# Altium schematic sheet Ball Gripper's Diodes and Fototransistors Connectors.SchDoc
size A4
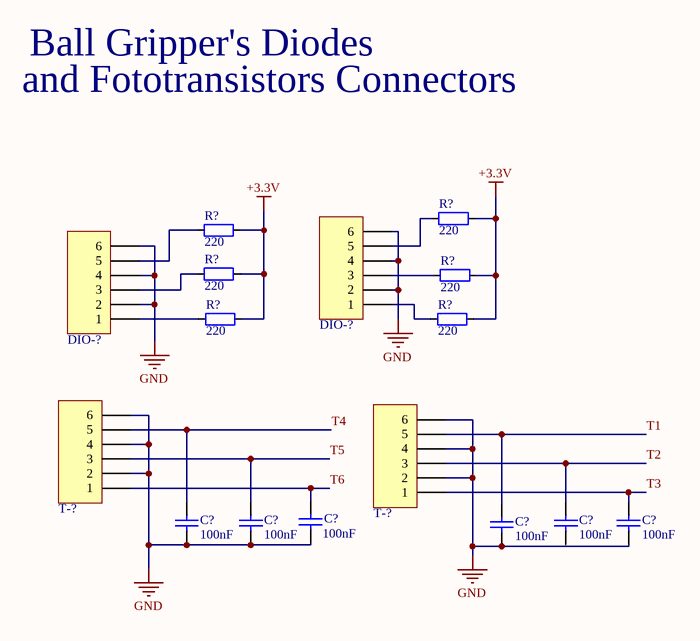
[diagram p0: Ball Gripper's Diodes and Fototransistors Connectors.SchDoc]

## Parts
(Parts that share a designator on the sheet are numbered #1, #2 ... from top to bottom, then left to right.)
C?#1  value 100nF  [0603_CAP]  (hidden comment: Cap)
C?#2  value 100nF  [0603_CAP]  (hidden comment: Cap)
C?#3  value 100nF  [0603_CAP]  (hidden comment: Cap)
C?#4  value 100nF  [0603_CAP]  (hidden comment: Cap)
C?#5  value 100nF  [0603_CAP]  (hidden comment: Cap)
C?#6  value 100nF  [0603_CAP]  (hidden comment: Cap)
DIO-?#1  HDR1X6  [Molex SPOX Horizontal 6 Circuits]  (value not drawn)
DIO-?#2  HDR1X6  [Molex SPOX Horizontal 6 Circuits]  (value not drawn)
R?#1  220  [0603]
R?#2  220  [0603]
R?#3  220  [0603]
R?#4  220  [0603]
R?#5  220  [0603]
R?#6  220  [0603]
T-?#1  HDR1X6  [Molex SPOX Horizontal 6 Circuits]  (value not drawn)
T-?#2  HDR1X6  [Molex SPOX Horizontal 6 Circuits]  (value not drawn)

## Nets
+3.3V: R?#1.1 R?#2.1 R?#3.1 R?#4.1 R?#5.1 R?#6.1
GND: C?#1.1 C?#2.1 C?#3.1 C?#4.1 C?#6.1 DIO-?#1.2 DIO-?#1.4 DIO-?#1.6 DIO-?#2.2 DIO-?#2.4 DIO-?#2.6 T-?#1.2 T-?#1.4 T-?#1.6 T-?#2.2 T-?#2.4 T-?#2.6
T1: C?#4.2 T-?#2.5
T2: C?#5.2 T-?#2.3
T3: C?#6.2 T-?#2.1
T4: C?#1.2 T-?#1.5
T5: C?#2.2 T-?#1.3
T6: C?#3.2 T-?#1.1
NetDIO-?#1_1: DIO-?#1.1 R?#6.2
NetDIO-?#1_3: DIO-?#1.3 R?#4.2
NetDIO-?#1_5: DIO-?#1.5 R?#1.2
NetDIO-?#2_1: DIO-?#2.1 R?#5.2
NetDIO-?#2_3: DIO-?#2.3 R?#3.2
NetDIO-?#2_5: DIO-?#2.5 R?#2.2

Not connected (* = marked no-connect by the designer): C?#5 1

## Notes on the sheet
- Ball Gripper's Diodes
- and Fototransistors Connectors

## Library data of the parts
C?#1-C?#6 = Cap: Ceramic capacitor; Unit Price1: *; Unit Price2: *
DIO-?#1 DIO-?#2 T-?#1 T-?#2 = HDR1X6: Header, 6-Pin; LatestRevisionDate: 17-Jul-2002; LatestRevisionNote: Re-released for DXP Platform.; Publisher: Altium Limited
R?#1-R?#6 = RES: Resistior; Value: 220